# EAGLE design tiaracon (EAGLE 7.6.0)
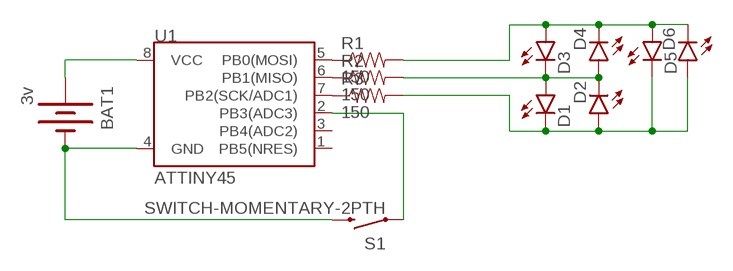
[diagram p0: schematic, sheet 1]

## Parts
BAT1  3v  BATTERY20PTH  [BATTCOM_20MM_PTH]
D1  LED3MM  [LED3MM]
D2  LED3MM  [LED3MM]
D3  LED3MM  [LED3MM]
D4  LED3MM  [LED3MM]
D5  LED3MM  [LED3MM]
D6  LED3MM  [LED3MM]
R1  150  RESISTORPTH-1/4W  [AXIAL-0.4]
R2  150  RESISTORPTH-1/4W  [AXIAL-0.4]
R3  150  RESISTORPTH-1/4W  [AXIAL-0.4]
S1  SWITCH-MOMENTARY-2PTH  [TACTILE-PTH]
U1  ATTINY45  ATTINY45TINY85-20-DIP  [DIP08]

## Nets
GND: BAT1.2(-) S1.3 U1.4(GND)
N$1: R1.P$1 U1.5(PB0(MOSI))
N$2: R2.P$1 U1.6(PB1(MISO))
N$3: R3.P$1 U1.7(PB2(SCK/ADC1))
N$4: S1.1 U1.2(PB3(ADC3))
N$6: D3.A D4.K(C) D5.A D6.K(C) R1.P$2
N$7: D1.K(C) D2.A D5.K(C) D6.A R3.P$2
N$8: D1.A D2.K(C) D3.K(C) D4.A R2.P$2
VCC: BAT1.1(+) U1.8(VCC)
Unconnected: U1.1(PB5(NRES)) U1.3(PB4(ADC2))

## Library data of the parts
BAT1 = SparkFun-Electromechanical:BATTERY: Battery Holders Various common sizes : AA, AAA, 18650 (PRT-12895), 20mm coin cell and 12mm coin cell. 20MM_4LEGS, BATT-10373
D1-D6 = SparkFun-LED:LED: LEDs Standard schematic elements and footprints for 5mm, 3mm, 1206, and 0603 sized LEDs. 5mm - Spark Fun Electronics SKU : COM-00529 (and others)
R1-R3 = SparkFun-Passives:RESISTOR: Resistor Basic schematic elements and footprints for 0603, 1206, and PTH resistors.
S1 = SparkFun-Electromechanical:SWITCH-MOMENTARY-2: Various NO switches- pushbuttons, reed, etc; PROD_ID: SWCH-08441
U1 = SparkFun-DigitalIC:ATTINY45: Atmel 8-pin 2/4/8kB flash uC; PROD_ID: IC-09445; VALUE: TINY85-20-DIP

## Board
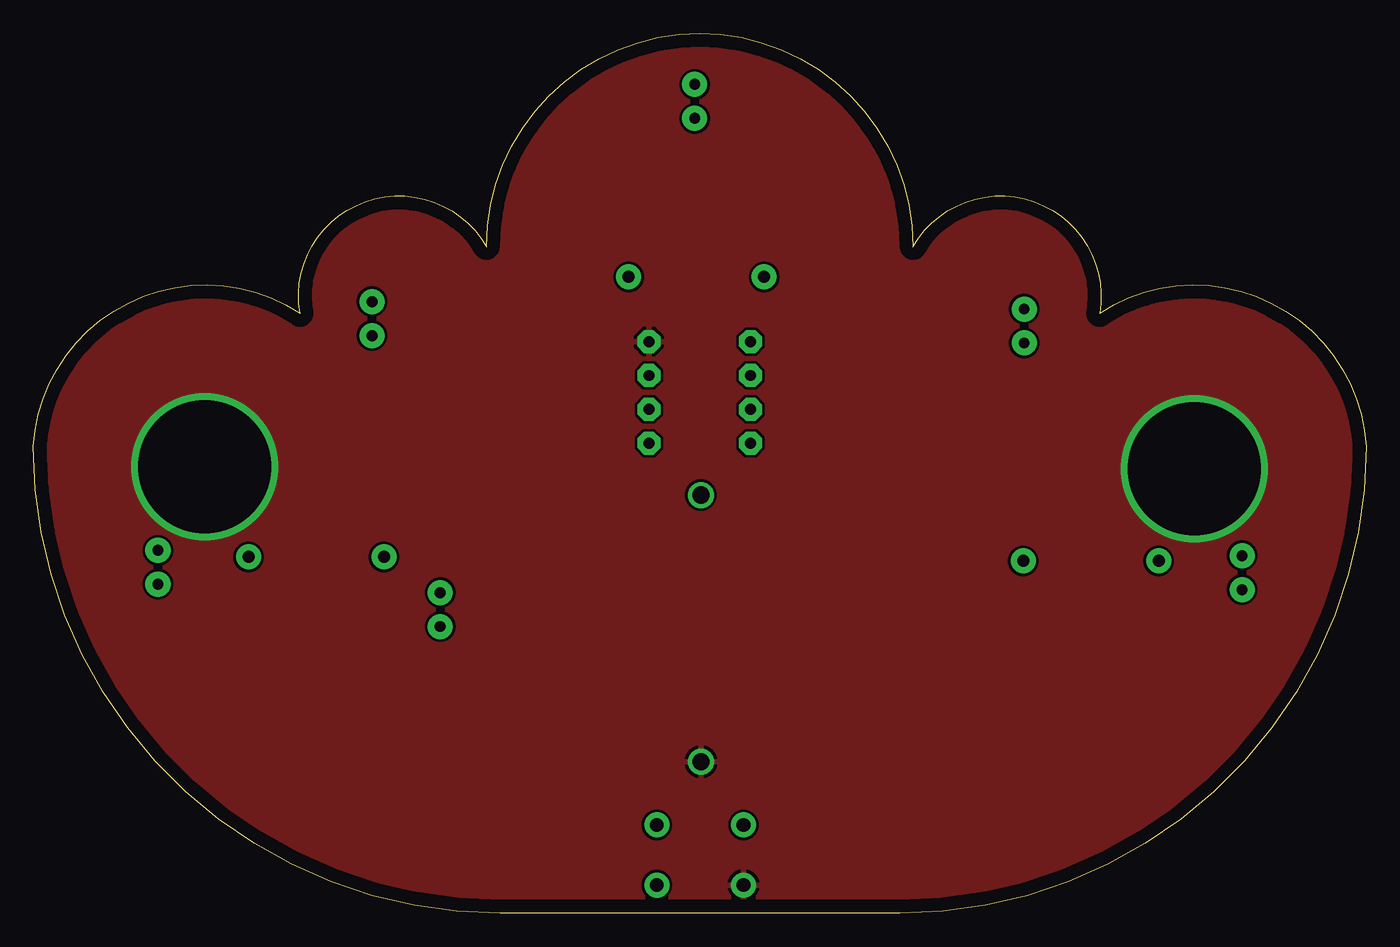
[diagram p1: board, top side]
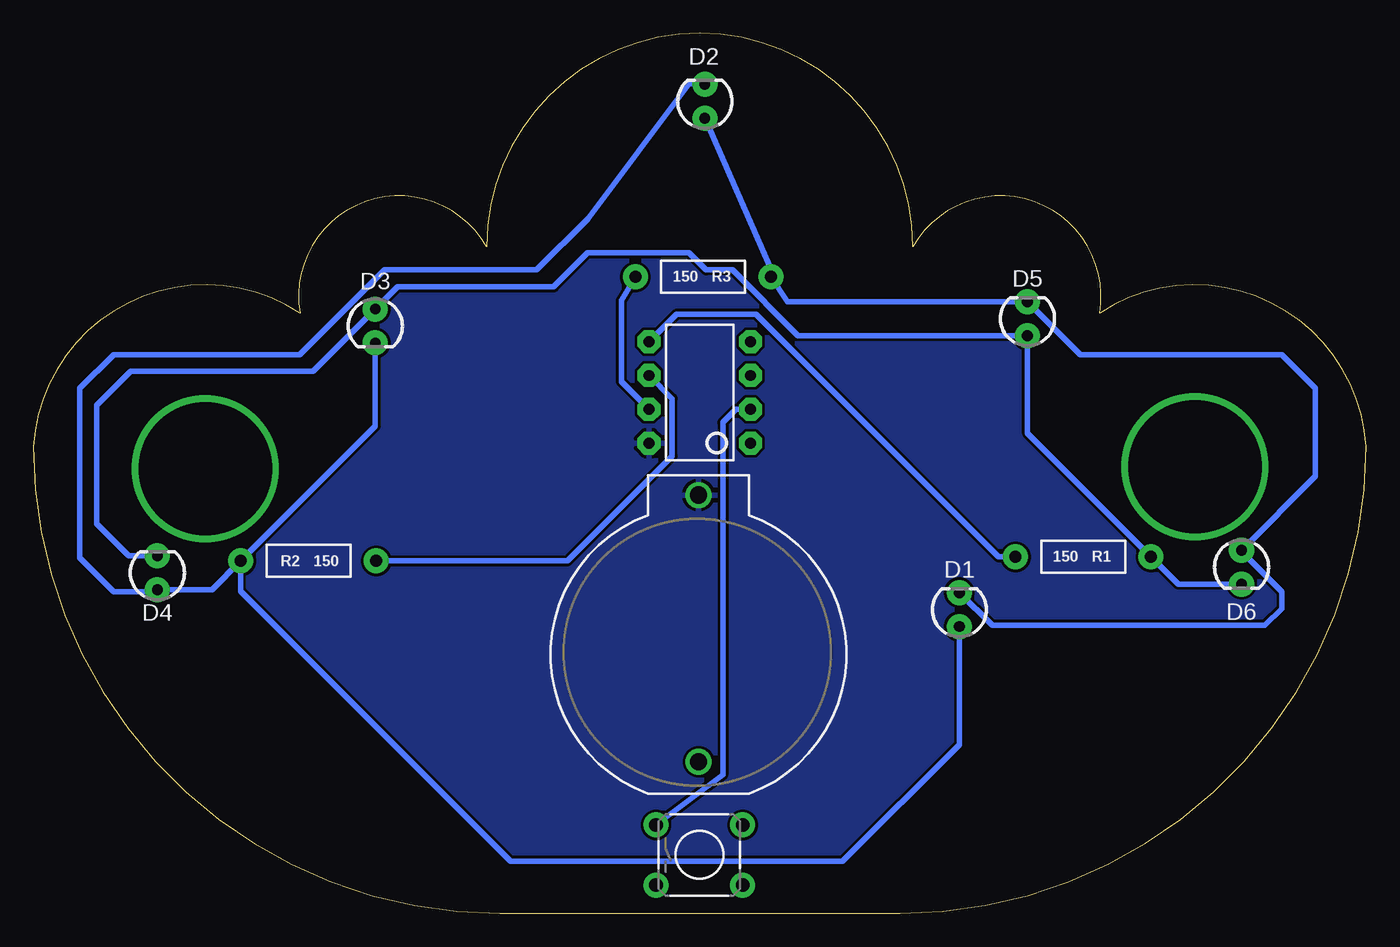
[diagram p2: board, bottom side, seen from below]

Size 100 x 66 mm. Coordinates in mm from the lower left corner, seen from the top.
Outline: 0,35 arc-120 20,45 arc-160 34,50 arc-180 66,50 arc-160 80,45 arc-120 100,35 arc-90 65,0 35,0 arc-90 0,35
Copper layers (1*16): Top 0.035mm / dielectric 1.5mm / Bottom 0.035mm
Design rules "default": minimum track width 10mil, minimum drill 24mil, track to track 8mil, track to pad 8mil, pad to pad 8mil, via to via 8mil, smd to smd 8mil, copper to edge 40mil, drill to drill 8mil, minimum pad ring 10mil, minimum via ring 8mil, stop-mask expansion 4mil, vias tented up to drill 0mil, thermal gap 10mil

### Footprints (pad centres in the part's own frame; a part is rotated, then mirrored left to right if it is on the bottom)
BATTCOM_20MM_PTH = drill 1.3: 1 11.85,0; 2 -8.15,0
LED3MM = drill 0.813 pad 1.88: A -1.27,0; K 1.27,0
AXIAL-0.4 = drill 0.9 pad 1.88: P$1 -5.08,0; P$2 5.08,0
TACTILE-PTH = drill 1.016 pad 1.88: 1 -3.251,2.261; 2 3.251,2.261; 3 -3.251,-2.261; 4 3.251,-2.261
DIP08 = drill 0.813 pad 1.727 octagon: 1 -3.81,-3.81; 2 -1.27,-3.81; 3 1.27,-3.81; 4 3.81,-3.81; 5 3.81,3.81; 6 1.27,3.81; 7 -1.27,3.81; 8 -3.81,3.81

### Placement (x,y rotation side)
BAT1  50.09,19.52 90 bottom
D1  30.52,22.78 90 bottom
D2  49.62,60.9 90 bottom
D3  74.34,44.05 270 bottom
D4  90.69,25.55 90 bottom
D5  25.41,44.6 90 bottom
D6  9.35,25.96 270 bottom
R1  21.23,26.73 0 bottom
R2  79.36,26.44 180 bottom
R3  49.75,47.73 0 bottom
S1  50.03,4.38 0 bottom
U1  50,39.07 90 bottom
U$1  [TIARA]  -0.7,-3.5 0 top  (outside the outline)
U$2  [PONY]  40.64,5.08 0 bottom

### Tracks (layer width: path | path; a pad name or v marks a point on that pad's centre or on a via)
GND  (via drill 10)
  other vias: 12.85,33.5 87.1,33.35
  pour Top: 0,0 100,0 100,75 0,75
N$1
  Bottom 0.406: U1.5 51.74,44.95 45.8,44.95 27.58,26.73 R1.P$1
N$2
  Bottom 0.406: R2.P$1 59.92,26.44 52.07,34.29 52.07,38.6 U1.6
N$3
  Bottom 0.406: U1.7 55.88,39.87 55.88,45.98 R3.P$1
N$4
  Bottom 0.406: U1.2 47.29,37.8 48.26,36.83 48.26,10.39 S1.1
N$6
  Bottom 0.406: D4.K 92.86,26.82 95.25,29.21 95.25,38.1 92.71,40.64 79.02,40.64 D3.A 72.67,46.99 60.96,46.99 58.42,49.53 50.8,49.53 49.53,48.26 47.56,48.26 42.63,43.33 D5.A 25.41,35.99 R1.P$2 14.11,24.69 D6.K
N$7
  Bottom 0.406: 30.44,24.13 D1.K 28.06,21.59 7.62,21.59 6.35,22.86 6.35,24.13 9.35,27.13 D6.A 3.81,32.77 3.81,39.37 6.35,41.91 21.45,41.91 D5.K 43.41,45.87 R3.P$2 44.62,48.23 D2.A
N$8
  Bottom 0.406: R2.P$2 86.6,24.28 D4.A 90.84,24.13 93.98,24.13 96.52,26.67 96.52,39.37 93.98,41.91 80.01,41.91 73.66,48.26 62.23,48.26 58.4,52.09 50.8,62.23 49.68,62.23 D2.K | D3.K 74.34,36.54 R2.P$2 | D1.A 30.52,12.66 39.28,3.9 64.2,3.9 84.44,24.14 R2.P$2
VCC
  pour Bottom: 0,0 100,0 100,75 0,75

### Text on the board
bDocu: long (+) leads / next to the 'D#' | long (+) leads / next to the 'D#' | TiaraCon 2016! / In partnership w/ / #brainbabe & CyberSN / Artwork: TeamTiara / PCB: @securelyfitz / https://git.io / /tiaracon